# Altium schematic sheet [04] - Compute Module.SchDoc: Compte Module & SD Card
size A3; DrawnBy: Farogh; Organization: Farogh Iftekhar; Address1: Defence Coloney; Address2: New Delhi; Revision: V1I0; SheetNumber: 4
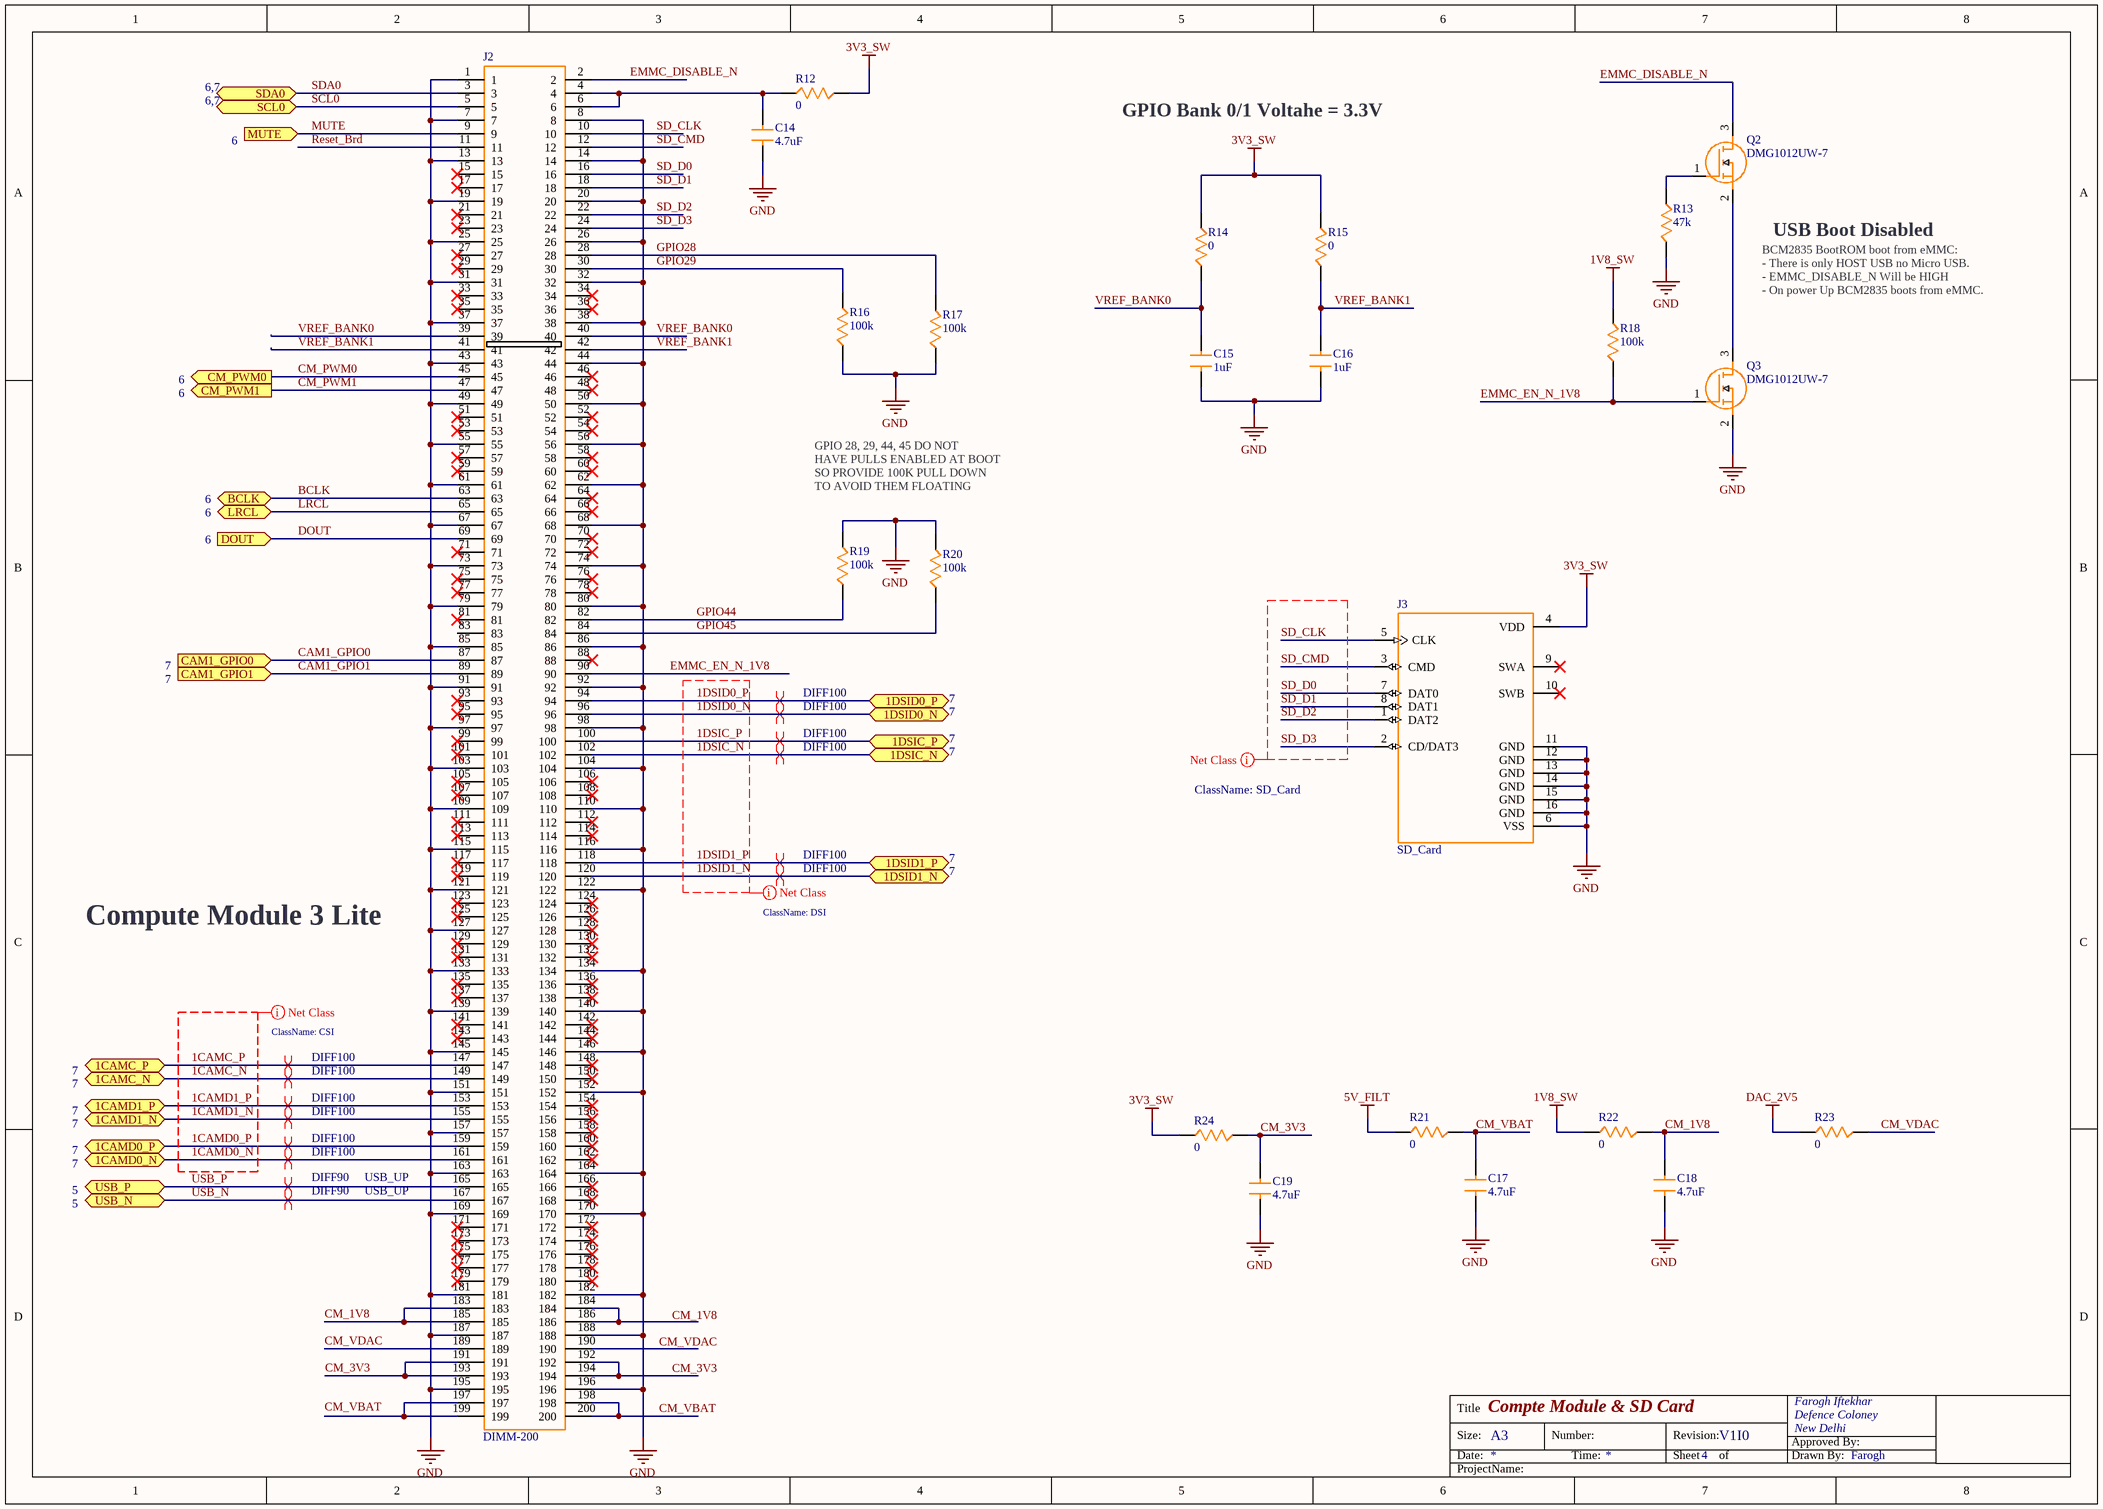
[diagram p0: [04] - Compute Module.SchDoc]

## Parts
C14  4.7uF  [C0805]
C15  1uF  [C0805]
C16  1uF  [C0805]
C17  4.7uF  [C0805]
C18  4.7uF  [C0805]
C19  4.7uF  [C0805]
J2  DIMM-200  [DIMM Connectors-200Pin]
J3  SD_Card  [2201778-1]
Q2  DMG1012UW-7  [DWG1012UW-7]
Q3  DMG1012UW-7  [DWG1012UW-7]
R12  0  [R0805]
R13  47k  [R0805]
R14  0  [R0805]
R15  0  [R0805]
R16  100k  [R0805]
R17  100k  [R0805]
R18  100k  [R0805]
R19  100k  [R0805]
R20  100k  [R0805]
R21  0  [R0805]
R22  0  [R0805]
R23  0  [R0805]
R24  0  [R0805]

## Ports
1CAMC_N (bidir, see 7), 1CAMC_P (bidir, see 7), 1CAMD0_N (bidir, see 7), 1CAMD0_P (bidir, see 7), 1CAMD1_N (bidir, see 7), 1CAMD1_P (bidir, see 7), 1DSIC_N (bidir, see 7), 1DSIC_P (bidir, see 7), 1DSID0_N (bidir, see 7), 1DSID0_P (bidir, see 7), 1DSID1_N (bidir, see 7), 1DSID1_P (bidir, see 7), BCLK (bidir, see 6), CAM1_GPIO0 (in, see 7), CAM1_GPIO1 (in, see 7), CM_PWM0 (out, see 6), CM_PWM1 (out, see 6), DOUT (in, see 6), LRCL (bidir, see 6), MUTE (in, see 6), SCL0 (bidir, see 6,7), SDA0 (see 6,7), USB_N (see 5), USB_P (see 5)

## Nets
1V8_SW: R18.2 R22.1
3V3_SW: J3.4(VDD) R12.2 R14.2 R15.2 R24.1
5V_FILT: R21.1
DAC_2V5: R23.1
GND: C14.1 C15.1 C16.1 C17.1 C18.1 C19.1 J2.1 J2.7 J2.8 J2.13 J2.14 J2.19 J2.20 J2.25 J2.26 J2.31 J2.32 J2.37 J2.38 J2.43 J2.44 J2.49 J2.50 J2.55 J2.56 J2.61 J2.62 J2.67 J2.68 J2.73 J2.74 J2.79 J2.80 J2.85 J2.86 J2.91 J2.92 J2.97 J2.98 J2.103 J2.104 J2.109 J2.110 J2.115 J2.116 J2.121 J2.122 J2.127 J2.133 J2.134 J2.139 J2.140 J2.145 J2.146 J2.151 J2.152 J2.157 J2.163 J2.164 J2.169 J2.170 J2.181 J2.182 J2.187 J2.188 J2.195 J2.196 J3.6(VSS) J3.11(GND) J3.12(GND) J3.13(GND) J3.14(GND) J3.15(GND) J3.16(GND) Q3.2(S) R13.1 R16.1 R17.1 R19.2 R20.2
1CAMC_N: J2.149 ; port 1CAMC_N
1CAMC_P: J2.147 ; port 1CAMC_P
1CAMD0_N: J2.161 ; port 1CAMD0_N
1CAMD0_P: J2.159 ; port 1CAMD0_P
1CAMD1_N: J2.155 ; port 1CAMD1_N
1CAMD1_P: J2.153 ; port 1CAMD1_P
1DSIC_N: J2.102 ; port 1DSIC_N
1DSIC_P: J2.100 ; port 1DSIC_P
1DSID0_N: J2.96 ; port 1DSID0_N
1DSID0_P: J2.94 ; port 1DSID0_P
1DSID1_N: J2.120 ; port 1DSID1_N
1DSID1_P: J2.118 ; port 1DSID1_P
BCLK: J2.63 ; port BCLK
CAM1_GPIO0: J2.87 ; port CAM1_GPIO0
CAM1_GPIO1: J2.89 ; port CAM1_GPIO1
CM_1V8: C18.2 J2.183 J2.185 R22.2
CM_3V3: C19.2 J2.191 J2.192 J2.193 J2.194 R24.2
CM_PWM0: J2.45 ; port CM_PWM0
CM_PWM1: J2.47 ; port CM_PWM1
CM_VBAT: C17.2 J2.198 J2.200 R21.2
CM_VDAC: J2.189 R23.2
DOUT: J2.69 ; port DOUT
EMMC_DISABLE_N: J2.2 Q2.3(D)
EMMC_EN_N_1V8: J2.90 Q3.1(G) R18.1
GPIO28: J2.28 R17.2
GPIO29: J2.30 R16.2
GPIO44: J2.82 R19.1
GPIO45: J2.84 R20.1
LRCL: J2.65 ; port LRCL
MUTE: J2.9 ; port MUTE
Reset_Brd: J2.11
SCL0: J2.5 ; port SCL0
SD_CLK: J2.10 J3.5(CLK)
SD_CMD: J2.12 J3.3(CMD)
SD_D0: J2.16 J3.7(DAT0)
SD_D1: J2.18 J3.8(DAT1)
SD_D2: J2.22 J3.1(DAT2)
SD_D3: J2.24 J3.2(CD/DAT3)
SDA0: J2.3 ; port SDA0
USB_N: J2.167 ; port USB_N
USB_P: J2.165 ; port USB_P
VREF_BANK0: C15.2 J2.39 J2.40 R14.1
VREF_BANK1: C16.2 J2.41 J2.42 R15.1
NetC14_2: C14.2 J2.4 J2.6 R12.1
NetJ2_184: J2.184 J2.186
NetJ2_197: J2.197 J2.199
NetQ2_1: Q2.1(G) R13.2
NetQ2_2: Q2.2(S) Q3.3(D)

Not connected (* = marked no-connect by the designer): J2 15* 17* 21* 23* 27* 29* 33* 34* 35* 36* 46* 48* 51* 52* 53* 54* 57* 58* 59* 60* 64* 66* 70* 71* 72* 75* 76* 77* 78* 81* 83 88* 93* 95* 99* 101* 105* 106* 107* 108* 111* 112* 113* 114* 117* 119* 123* 124* 125* 126* 128* 129* 130* 131* 132* 135* 136* 137* 138* 141* 142* 143* 144* 148* 150* 154* 156* 158* 160* 162* 166* 168* 171* 172* 173* 174* 175* 176* 177* 178* 179* 180* 190; J3 9(SWA)* 10(SWB)*

## Layout directives
differential pair; net class DIFF100: 1CAMC_N, 1CAMC_P, 1CAMD0_N, 1CAMD0_P, 1CAMD1_N, 1CAMD1_P, 1DSIC_N, 1DSIC_P, 1DSID0_N, 1DSID0_P, 1DSID1_N, 1DSID1_P
net class CSI: 1CAMC_N, 1CAMC_P, 1CAMD0_N, 1CAMD0_P, 1CAMD1_N, 1CAMD1_P
differential pair; net class DIFF90; net class USB_UP: USB_N, USB_P
net class DSI: 1DSIC_N, 1DSIC_P, 1DSID0_N, 1DSID0_P, 1DSID1_N, 1DSID1_P
net class SD_Card: SD_CLK, SD_CMD, SD_D0, SD_D1, SD_D2, SD_D3

## Notes on the sheet
- GPIO Bank 0/1 Voltahe = 3.3V
- (near Q2) USB Boot Disabled
- BCM2835 BootROM boot from eMMC:
- - There is only HOST USB no Micro USB.
- - EMMC_DISABLE_N Will be HIGH
- - On power Up BCM2835 boots from eMMC.
- GPIO 28, 29, 44, 45 DO NOT
- HAVE PULLS ENABLED AT BOOT
- SO PROVIDE 100K PULL DOWN
- TO AVOID THEM FLOATING
- Compute Module 3 Lite
- Labels drawn without touching a wire or pin: CM_1V8, CM_VBAT, CM_VDAC
- Title
- Size:
- Date:
- A3
- Number:
- Time:
- Revision:
- Sheet
- of
- Approved By:
- Drawn By:
- ProjectName:

## Library data of the parts
C14 C17-C19 = C_0805-4.7uF: Multilayer Ceramic Capacitors MLCC - SMD/SMT FACTORY NOT ACCEPTING ORDERS; Manufacturer: KEMET; Manufacturer Part Number: C0805X475K4RACAUTO; Tolerance: 10 %; Type: X7R Dielectric; Voltage Rating DC: 16 VDC; Capacitance - nF: 4700 nF; Class: Class 2; Dielectric: X7R; Qualification: AEC-Q200; Product Status: New Product; Supplier 1: Mouser; RoHS: RoHS Compliant; Category: Multilayer Ceramic Capacitors MLCC - SMD/SMT; Stock 1: 4312; Pricing 1: 1=0.860, 10=0.582, 100=0.363, 500=0.328, 1000=0.300, 2500=0.196, 10000=0.186, 25000=0.182, 50000=0.175 (USD); Capacitance: 4.7 uF; Height: 1.25 mm; Length: 2 mm; Package / Case: 0805 (2012 metric); Packaging: Reel; Product: Automotive MLCCs; Series: SMD Auto X7R Flex; Termination Style: SMD/SMT; Width: 1.25 mm; Brand: KEMET; Case Code - in: 0805; Case Code - mm: 2012; Maximum Operating Temperature: + 125 C; Minimum Operating Temperature: - 55 C; Product Type: Ceramic Capacitors; Standard Pack Qty: 2500; Subcategory: Capacitors; Termination: Flexible (Soft); Tradename: FT-CAP; RoHS - Mouser: Y; Minimum Order Quantity: 2500; Reeling: True; ComponentLink1URL: https://www.mouser.com/datasheet/2/212/KEM_C1078_X7R_FT-CAP_AUTO_SMD-1103315.pdf; ComponentLink1Description: https://www.mouser.com/datasheet/2/212/KEM_C1078_X7R_FT-CAP_AUTO_SMD-1103315.pdf; Supplier Part Number 1: 80-C0805X475K4RAUTO
C15 C16 = C_0805-1uF: Multilayer Ceramic Capacitors MLCC - SMD/SMT 10V 1uF X7R 0805 10%; Manufacturer: KEMET; Manufacturer Part Number: C0805C105K8RAC7210; Voltage Rating DC: 10 VDC; Capacitance - nF: 1000 nF; Class: Class 2; Product Status: New Product; Supplier 1: Mouser; RoHS: RoHS Compliant; Category: Multilayer Ceramic Capacitors MLCC - SMD/SMT; Stock 1: 38596; Pricing 1: 1=0.230, 10=0.104, 100=0.064, 500=0.057, 1000=0.048, 2000=0.041, 10000=0.036, 15000=0.032, 45000=0.028 (USD); Capacitance: 1 uF; Height: 0.9 mm; Length: 2 mm; Package / Case: 0805 (2012 metric); Packaging: Cut Tape; Product: General Type MLCCs; Series: SMD Comm X7R; Termination Style: SMD/SMT; Tolerance: 10 %; Width: 1.25 mm; Brand: KEMET; Case Code - in: 0805; Case Code - mm: 2012; Dielectric: X7R; Maximum Operating Temperature: + 125 C; Minimum Operating Temperature: - 55 C; Product Type: Ceramic Capacitors; Standard Pack Qty: 15000; Subcategory: Capacitors; Termination: Standard; RoHS - Mouser: Y; Minimum Order Quantity: 1; Reeling: True; ComponentLink1URL: https://www.mouser.com/datasheet/2/212/KEM_C1002_X7R_SMD-1102033.pdf; ComponentLink1Description: https://www.mouser.com/datasheet/2/212/KEM_C1002_X7R_SMD-1102033.pdf; Supplier Part Number 1: 80-C0805C105K8R7210
J2 = TE_DIMM, 0.6MM: DIMM Connectors .6MM 200D R/SM 1.8V DIMMSO DDR; Manufacturer: TE Connectivity / AMP; Manufacturer Part Number: 1473149-4; Mounting Angle: Right; Number of Positions: 200 Position; Pitch: 0.6 mm; Supplier 1: Mouser; RoHS: RoHS Compliant; Category: DIMM Connectors; Stock 1: 8127; Pricing 1: 1=2.45, 50=2.26, 100=2.10 (USD); Contact Plating: Gold; Height: 5.2 mm; Housing Material: Thermoplastic (TP); Packaging: Tray; Product: SODIMM; Termination Style: SMD/SMT; Type: DDR2; Voltage Rating: 1.8 V; Brand: TE Connectivity / AMP; Contact Material: Copper Alloy; Product Type: DIMM Connectors; Standard Pack Qty: 20; Subcategory: Memory Connectors & Sockets; RoHS - Mouser: Y; Minimum Order Quantity: 1; Reeling: False; ComponentLink1URL: https://www.mouser.com/datasheet/2/418/NG_CD_1473149_K3-1239525.pdf; ComponentLink1Description: https://www.mouser.com/datasheet/2/418/NG_CD_1473149_K3-1239525.pdf; Supplier Part Number 1: 571-1473149-4
J3 = SD-Card Slot: Memory Card Connectors MICRO SD PUSH LOW PROFILE TYPE; Manufacturer: TE Connectivity; Card Type: SIM; CNHTS: 8538900000; MXHTS: 85366999; TARIC: 8536909599; Supplier 1: Mouser; Manufacturer Part Number: 2201778-1; RoHS: RoHS Compliant; Category: Memory Card Connectors; Stock 1: 4643; Pricing 1: 1=2.57, 10=2.16, 100=1.80, 500=1.75, 1000=1.41 (USD); Contact Plating: Gold; Housing Material: Thermoplastic (TP); Packaging: Cut Tape; Series: DYNAMIC; Termination Style: SMD/SMT; Brand: TE Connectivity; Contact Material: Copper Alloy; HTS Code: 8536694040; Product Type: Memory Card Connectors; Standard Pack Qty: 1000; Subcategory: Memory Connectors & Sockets; RoHS - Mouser: Y; Minimum Order Quantity: 1; Reeling: True; ComponentLink1URL: http://www.mouser.com/datasheet/2/418/PN_CD_2201778_B-1150756.pdf; ComponentLink1Description: http://www.mouser.com/datasheet/2/418/PN_CD_2201778_B-1150756.pdf; Supplier Part Number 1: 571-2201778-1
Q2 Q3 = DMG1012UW-7 (2): MOSFET MOSFET N-CHANNEL SOT-323; Manufacturer: Diodes Incorporated; Configuration: Single; Transistor Type: 1 N-Channel; Number of Channels: 1 Channel; Channel Mode: Enhancement; CNHTS: 8541210000; Fall Time: 12.3 ns; Id - Continuous Drain Current: 1 A; MXHTS: 85412101; Pd - Power Dissipation: 290 mW; Qg - Gate Charge: 736.6 pC; Rds On - Drain-Source Resistance: 450 mOhms; Rise Time: 7.4 ns; Typical Turn-Off Delay Time: 26.7 ns; Typical Turn-On Delay Time: 5.1 ns; Vds - Drain-Source Breakdown Voltage: 20 V; Vgs - Gate-Source Voltage: 4.5 V; Vgs th - Gate-Source Threshold Voltage: 500 mV; Supplier 1: Mouser; Manufacturer Part Number: DMG1012UW-7; RoHS: RoHS Compliant; Category: MOSFET; Stock 1: 210682; Pricing 1: 1=0.330, 10=0.225, 100=0.094, 1000=0.064, 3000=0.050, 9000=0.043, 24000=0.040, 45000=0.038 (USD); Package / Case: SOT-323-3; Packaging: Cut Tape; Product: MOSFET Small Signal; Series: DMG1012; Technology: Si; Brand: Diodes Incorporated; Mounting Style: SMD/SMT; Transistor Polarity: N-Channel; HTS Code: 8541210095; Maximum Operating Temperature: + 150 C; Minimum Operating Temperature: - 55 C; Product Type: MOSFET; Standard Pack Qty: 3000; Subcategory: MOSFETs; TARIC: 8541210000; RoHS - Mouser: Y; Minimum Order Quantity: 1; Reeling: True; ComponentLink1URL: http://www.mouser.com/datasheet/2/115/ds31859-90313.pdf; ComponentLink1Description: http://www.mouser.com/datasheet/2/115/ds31859-90313.pdf; Supplier Part Number 1: 621-DMG1012UW-7
R12 R14 R15 R21-R24 = R_0805-0: Current Sense Resistors - SMD 0 ohm Jumper 1/2W; Manufacturer: Yageo; Manufacturer Part Number: PA0805-R-470RL; Power Rating: 500 mW (1/2 W); Resistance: 0 Ohms; CNHTS: 8533211000; TARIC: 8533210000; Product Status: New Product; Supplier 1: Mouser; RoHS: RoHS Compliant; Category: Current Sense Resistors - SMD; Stock 1: 3927; Pricing 1: 1=1.30, 10=1.06, 100=0.706, 500=0.595, 1000=0.495, 5000=0.431, 10000=0.421, 25000=0.409 (USD); Application: Current Sense; Length: 2.03 mm; Packaging: Cut Tape; Product: Current Sense Chip Resistor Surface Mount; Series: PA_L; Technology: Metal Element; Termination Style: SMD/SMT; Tolerance: -; Type: Low TCR Current Sense Resistor; Width: 1.27 mm; Brand: Yageo; Mounting Style: PCB Mount; Case Code - in: 0805; Case Code - mm: 2012; HTS Code: 8533210030; Maximum Operating Temperature: + 155 C; Minimum Operating Temperature: - 55 C; Product Type: Current Sense Resistors; Standard Pack Qty: 5000; Subcategory: Resistors; Termination: 2 Terminal; RoHS - Mouser: Y; Minimum Order Quantity: 1; Reeling: True; ComponentLink1URL: http://www.mouser.com/datasheet/2/447/PYu-PA0805_L_51_RoHS_0-1480254.pdf; ComponentLink1Description: http://www.mouser.com/datasheet/2/447/PYu-PA0805_L_51_RoHS_0-1480254.pdf; Supplier Part Number 1: 603-PA0805-R-470RL
R13 = R_0805-47K: Thin Film Resistors - SMD; Manufacturer: Yageo; Manufacturer Part Number: RT0805DRD0747KL; Power Rating: 125 mW (1/8 W); Resistance: 47 kOhms; Temperature Coefficient: 25 PPM / C; Tolerance: 0.5 %; Voltage Rating: 150 V; CNHTS: 8533211000; MXHTS: 85332101; TARIC: 8533210000; Supplier 1: Mouser; RoHS: RoHS Compliant; Category: Thin Film Resistors - SMD; Stock 1: 9318; Pricing 1: 1=0.270, 10=0.162, 100=0.053, 1000=0.037, 5000=0.028, 10000=0.026, 25000=0.025, 50000=0.024 (USD); Features: -; Height: 0.5 mm; Length: 2 mm; Operating Temperature Range: - 55 C to + 125 C; Package / Case: 0805 (2012 metric); Packaging: Cut Tape; Product: Thin Film Resistors SMD; Series: RT; Termination Style: SMD/SMT; Type: High Precision, High Stability; Width: 1.25 mm; Brand: Yageo; Case Code - in: 0805; Case Code - mm: 2012; HTS Code: 8533210030; Maximum Operating Temperature: + 125 C; Minimum Operating Temperature: - 55 C; Product Type: Thin Film Resistors; Standard Pack Qty: 5000; Subcategory: Resistors; RoHS - Mouser: Y; Minimum Order Quantity: 1; Reeling: True; ComponentLink1URL: http://www.mouser.com/datasheet/2/447/PYu-RT_1-to-0.01_RoHS_L_9-1222720.pdf; ComponentLink1Description: http://www.mouser.com/datasheet/2/447/PYu-RT_1-to-0.01_RoHS_L_9-1222720.pdf; Supplier Part Number 1: 603-RT0805DRD0747KL
R16-R20 = R_0805-100K: Thick Film Resistors - SMD 100K ohm 1% 150V AEC-Q200; Manufacturer: Yageo; Manufacturer Part Number: AC0805FR-13100KL; Power Rating: 125 mW (1/8 W); Resistance: 100 kOhms; Temperature Coefficient: 100 PPM / C; Product Status: New Product; Supplier 1: Mouser; Category: Thick Film Resistors - SMD; Stock 1: 38013; Pricing 1: 1=0.160, 10=0.037, 100=0.013, 1000=0.010, 2500=0.006, 20000=0.005 (USD); Application: Automotive Grade; Features: -; Height: 0.5 mm; Length: 2 mm; Package / Case: 0805 (2012 metric); Packaging: Cut Tape; Product: Thick Film Resistors SMD; Series: AC; Technology: Thick Film; Termination Style: SMD/SMT; Tolerance: 1 %; Voltage Rating: 150 V; Width: 1.25 mm; Brand: Yageo; Mounting Style: PCB Mount; Case Code - in: 0805; Case Code - mm: 2012; HTS Code: 8533210030; Maximum Operating Temperature: + 155 C; Minimum Operating Temperature: - 55 C; Product Type: Thick Film Resistors; Standard Pack Qty: 20000; Subcategory: Resistors; Minimum Order Quantity: 1; Reeling: True; ComponentLink1URL: http://www.mouser.com/datasheet/2/447/PYu-AC_51_RoHS_L_6-1152827.pdf; ComponentLink1Description: http://www.mouser.com/datasheet/2/447/PYu-AC_51_RoHS_L_6-1152827.pdf; Supplier Part Number 1: 603-AC0805FR-13100KL